# Altium schematic sheet charger.SchDoc
size A4; PageSetup: Record=PageOptions|CenterHorizontal=True|CenterVertical=True|PrintScale=0.97|XCorrection=1.00|YCorrection=1.00|PrintKind=0|BorderSize=5000000|LeftOffset=0|BottomOffset=0|Orientation=2|PaperLength=1000|PaperWidth=1000|Scale=100|PaperSource=7|PrintQuality=-4|MediaType=1|DitherType=10|PaperKind=A4|PrintScaleMode=1
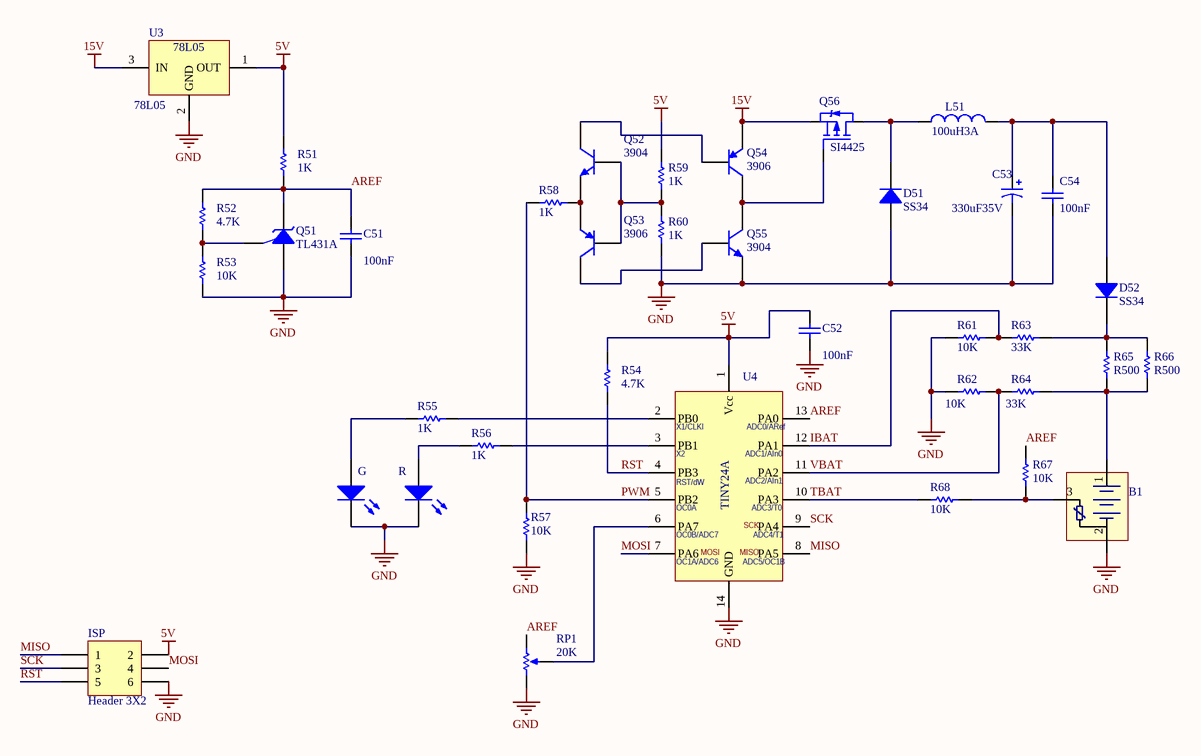
[diagram p0: charger.SchDoc]

## Parts
B1  BATT  [BATT]  (value not drawn)
C51  value 100nF  [CAP0805]  (hidden comment: Cap)
C52  value 100nF  [CAP0805]  (hidden comment: Cap)
C53  330uF35V  [CAP10x16]
C54  value 100nF  [CAP0805]  (hidden comment: Cap)
D51  SS34  [DO214A]
D52  SS34  [DO214A]
G  高亮翠绿  [LED2G_SLIM]  (value not drawn)
ISP  Header 3X2  [HDR2X3_EMPTY]
L51  100uH3A  [INDUCTOR]
Q51  TL431A  [SOT23_431]
Q52  3904  [SOT23_CBE]
Q53  3906  [SOT23_CBE]
Q54  3906  [SOT23_CBE]
Q55  3904  [SOT23_CBE]
Q56  SI4425  [SO8-MOS]
R  高亮红  [LED2R_SLIM]  (value not drawn)
R51  value 1K  [RES0805]  (hidden comment: Res1)
R52  value 4.7K  [RES0805]  (hidden comment: Res1)
R53  value 10K  [RES0805]  (hidden comment: Res1)
R54  value 4.7K  [RES0805]  (hidden comment: Res1)
R55  value 1K  [RES0805]  (hidden comment: Res1)
R56  value 1K  [RES0805]  (hidden comment: Res1)
R57  value 10K  [RES0805]  (hidden comment: Res1)
R58  value 1K  [RES0805]  (hidden comment: Res1)
R59  value 1K  [RES0805]  (hidden comment: Res1)
R60  value 1K  [RES0805]  (hidden comment: Res1)
R61  value 10K  [RES0805]  (hidden comment: Res1)
R62  value 10K  [RES0805]  (hidden comment: Res1)
R63  value 33K  [RES0805]  (hidden comment: Res1)
R64  value 33K  [RES0805]  (hidden comment: Res1)
R65  value R500  [RES2512]  (hidden comment: Res1)
R66  value R500  [RES2512]  (hidden comment: Res1)
R67  value 10K  [RES0805]  (hidden comment: Res1)
R68  value 10K  [RES0805]  (hidden comment: Res1)
RP1  value 20K  [POT3x3]  (hidden comment: RPot)
U3  78L05  [SOT89_VREG]
U4  TINY24A  [SO14]  (value not drawn)

## Nets
5V: C52.2 ISP.2 R51.2 R54.2 R59.2 U3.1(OUT) U4.1(Vcc)
15V: Q54.E Q56.S U3.3(IN)
GND: B1.2(B-) C51.1 C52.1 C53.2 C54.1 D51.1(A) G.2(K) ISP.6 Q51.2(A) Q55.E R.2(K) R53.1 R57.2 R60.1 R61.2 R62.2 RP1.1(TOP) U3.2(GND) U4.14(GND)
AREF: C51.2 Q51.3(C) R51.1 R52.2 R67.2 RP1.2(BOT) U4.13(PA0)
IBAT: R61.1 R63.2 U4.12(PA1)
MISO: ISP.1 U4.8(PA5)
MOSI: ISP.4 U4.7(PA6)
PWM: R57.1 R58.2 U4.5(PB2)
RST: ISP.5 R54.1 U4.4(PB3)
SCK: ISP.3 U4.9(PA4)
TBAT: R68.2 U4.10(PA3)
VBAT: R62.1 R64.2 U4.11(PA2)
NetB1_1: B1.1(B+) R64.1 R65.1 R66.1
NetB1_3: B1.3(T) R67.1 R68.1
NetC53_1: C53.1 C54.2 D52.1(A) L51.2
NetD51_2: D51.2(K) L51.1 Q56.D
NetD52_2: D52.2(K) R63.1 R65.2 R66.2
NetG_1: G.1(A) R55.2
NetQ51_1: Q51.1(R) R52.1 R53.2
NetQ52_B: Q52.B Q53.B R59.1 R60.2
NetQ52_C: Q52.C Q54.B
NetQ52_E: Q52.E Q53.E R58.1
NetQ53_C: Q53.C Q55.B
NetQ54_C: Q54.C Q55.C Q56.G
NetR55_1: R55.1 U4.2(PB0)
NetR56_1: R56.1 U4.3(PB1)
NetR_1: R.1(A) R56.2
NetRP1_3: RP1.3(TAP) U4.6(PA7)

## Notes on the sheet
- (in symbol TINY13A) X1/CLKI; ADC0/ARef; X2; ADC1/AIn0; RST/dW; ADC2/AIn1; OC0A; ADC3/T0; SCK; OC0B/ADC7; ADC4/T1; MOSI; MISO; OC1A/ADC6; ADC5/OC1B

## Library data of the parts
B1 = BATT: 电池座
C51 C52 C54 = Cap: 贴片电容; Published: 8-Jun-2000; LatestRevisionDate: 17-Jul-2002; LatestRevisionNote: Re-released for DXP Platform.; PackageReference: RAD-0.3; Publisher: Altium Limited; PackageDescription: Radial Cap, Thru-Hole; 2 Leads; 0.3 in Pin Spacing
C53 = Cap Pol2: 电解电容; Published: 8-Jun-2000; LatestRevisionDate: 17-Jul-2002; LatestRevisionNote: Re-released for DXP Platform.; Publisher: Altium Limited
D51 D52 = Diode: 贴片二极管; Published: 8-Jun-2000; LatestRevisionDate: 17-Jul-2002; LatestRevisionNote: Re-released for DXP Platform.; DatasheetDocument: 1999; PackageDocument: Aug-1999; PackageReference: DO-41; Publisher: Altium Limited; ComponentLink1Description: Manufacturer Link; ComponentLink1URL: http://www.fairchildsemi.com/; Code_JEDEC: DO-204-AL
G R = LED: 贴片二极管 0805; Published: 8-Jun-2000; LatestRevisionDate: 08-Jul-2005; LatestRevisionNote: Mech Layer 1 removed.; PackageReference: LED-0; Publisher: Altium Limited; PackageDescription: LED; 2 Leads
ISP = Header 3X2: 空; LatestRevisionDate: 17-Jul-2002; LatestRevisionNote: Re-released for DXP Platform.; Publisher: Altium Limited
L51 = Inductor: 工字电感; Code_IEC: 1005; Published: 8-Jun-2000; LatestRevisionDate: 17-Jul-2002; LatestRevisionNote: Re-released for DXP Platform.; PackageReference: 0402-A; Publisher: Altium Limited; Code_JEITA: 0402
Q51 = TL431: 基准集成电路; Accuracy: 0.5%; Published: 8-Jun-2000; LatestRevisionDate: 17-Jul-2002; LatestRevisionNote: Re-released for DXP Platform.; Publisher: Altium Limited
Q52 Q55 = NPN: NPN 三极管; Published: 8-Jun-2000; LatestRevisionDate: 17-Jul-2002; LatestRevisionNote: Re-released for DXP Platform.; PackageReference: TO-226-AA; Publisher: Altium Limited; PackageDescription: TO, Flat Index; 3 In-Line, Axial Leads; Body Dia. 4.8mm; Leads 0.55 x 0.51 mm (max); Code_JEDEC: TO-226-AA
Q53 Q54 = PNP: PNP 三极管; Published: 8-Jun-2000; LatestRevisionDate: 15-Jan-2003; LatestRevisionNote: PCB Footprint 'BCY-W3/D4.7' replaced; DatasheetVersion: 1997; PackageVersion: Sep-1998; PackageReference: TO-92A; Publisher: Altium Limited; PackageDescription: TO, Flat Index; 3 In-Line, Axial Leads; Body Dia. 4.5mm; Leads 0.51 x 0.48 mm (max); ComponentLink1Description: Manufacturer Link; ComponentLink1URL: http://www.fairchildsemi.com/; ComponentLink2Description: Datasheet; ComponentLink2URL: http://www.fairchildsemi.com/ds/2N%2F2N3906.pdf
Q56 = PMOS: 低压 PMOS; Published: 8-Jun-2000; LatestRevisionDate: 17-Jul-2002; LatestRevisionNote: Re-released for DXP Platform.; PackageVersion: 1995/1996; PackageReference: E3; Publisher: Altium Limited; PackageDescription: TO, Flat Index; 3 In-Line, Axial Leads; Body Dia. 4.6mm; Lead Dia. 0.5 mm (max)
R51-R64 R67 R68 = Res1: 贴片电阻; Accuracy: 1%; Published: 8-Jun-2000; LatestRevisionDate: 17-Jul-2002; LatestRevisionNote: Re-released for DXP Platform.; PackageReference: AXIAL-0.3; Publisher: Altium Limited; PackageDescription: Axial Device, Thru-Hole; 2 Leads; 0.3 in Pin Spacing
R65 R66 = Res1: 贴片电阻; Published: 8-Jun-2000; LatestRevisionDate: 17-Jul-2002; LatestRevisionNote: Re-released for DXP Platform.; PackageReference: AXIAL-0.3; Publisher: Altium Limited; PackageDescription: Axial Device, Thru-Hole; 2 Leads; 0.3 in Pin Spacing
RP1 = RPot: 贴片电位器; Sim Note: Enter the Resistance value and the set point into parameter fields.; Set Position: 0.5; Published: 8-Jun-2000; LatestRevisionDate: 17-Jul-2002; LatestRevisionNote: Re-released for DXP Platform.; PackageReference: VR5; Publisher: Altium Limited; PackageDescription: Variable Resistor, Thru-Hole; 3 Leads
U3 = 78L05: 三端稳压贴片; Published: 24-Aug-2001; LatestRevisionDate: 6-Jun-2005; LatestRevisionNote: PCB pads lengthened.; DatasheetDocument: Apr-1994; PackageDocument: Jun-2004; PackageReference: TO-252; Publisher: Altium Limited; ComponentLink1Description: Manufacturer Link; ComponentLink1URL: http://www.st.com/
U4 = TINY13A: 集成电路